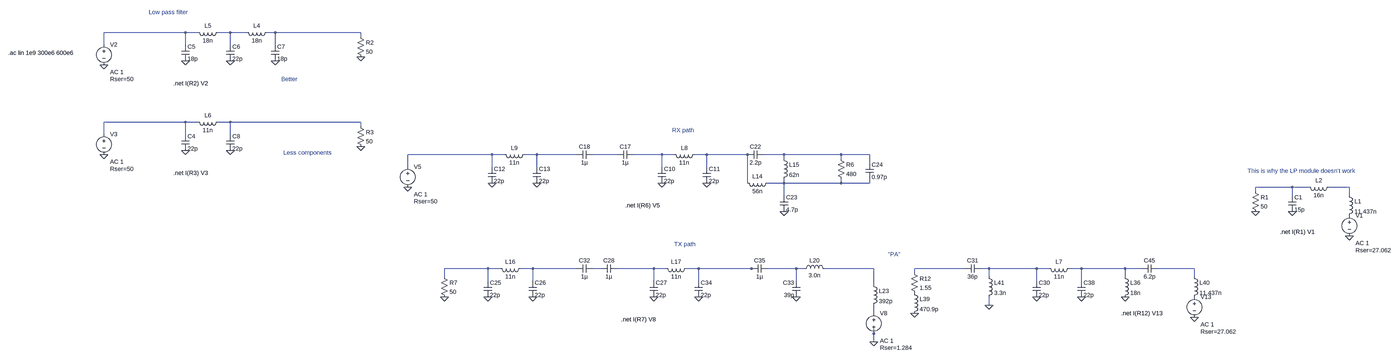
[diagram p0: schematic HP_module.asc, whole sheet]
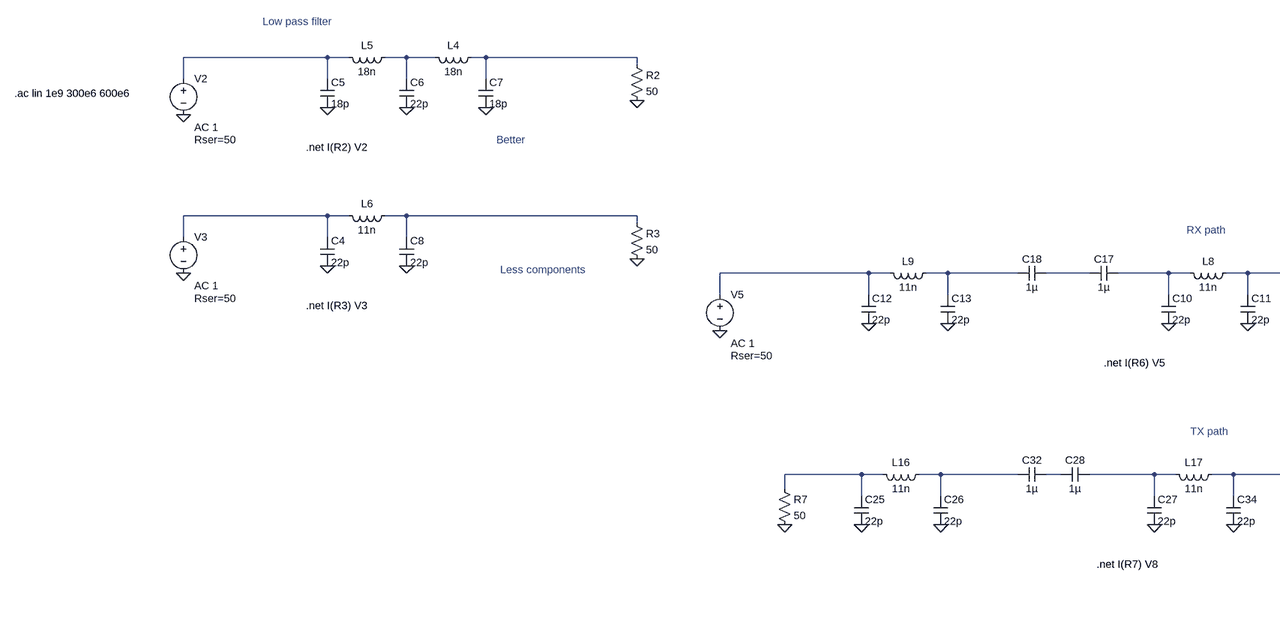
[diagram p1: schematic HP_module.asc, part, row 1 of 1, column 1 of 2]
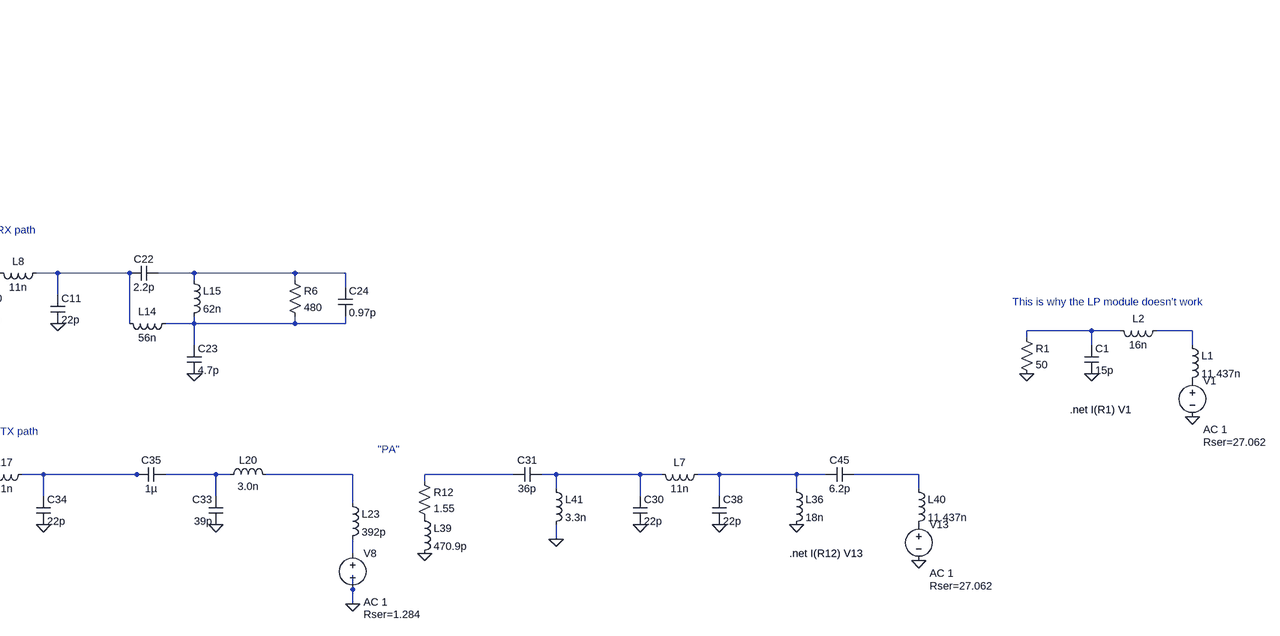
[diagram p2: schematic HP_module.asc, part, row 1 of 1, column 2 of 2]
HP_module.asc, the LTspice schematic file:
Version 4
SHEET 1 6100 2548
WIRE 304 656 -16 656
WIRE 352 656 304 656
WIRE 480 656 432 656
WIRE 544 656 480 656
WIRE 656 656 624 656
WIRE 992 656 656 656
WIRE 992 672 992 656
WIRE -16 704 -16 656
WIRE 304 704 304 656
WIRE 480 704 480 656
WIRE 656 704 656 656
WIRE 304 1072 -16 1072
WIRE 352 1072 304 1072
WIRE 480 1072 432 1072
WIRE 992 1072 480 1072
WIRE 992 1088 992 1072
WIRE -16 1120 -16 1072
WIRE 304 1120 304 1072
WIRE 480 1120 480 1072
WIRE 1792 1200 1328 1200
WIRE 1840 1200 1792 1200
WIRE 1968 1200 1920 1200
WIRE 2128 1200 1968 1200
WIRE 2288 1200 2192 1200
WIRE 2464 1200 2352 1200
WIRE 2512 1200 2464 1200
WIRE 2640 1200 2592 1200
WIRE 2896 1200 2640 1200
WIRE 2912 1200 2896 1200
WIRE 3040 1200 2960 1200
WIRE 3264 1200 3040 1200
WIRE 3376 1200 3264 1200
WIRE 3040 1216 3040 1200
WIRE 3264 1216 3264 1200
WIRE 3376 1232 3376 1200
WIRE 1328 1248 1328 1200
WIRE 1792 1248 1792 1200
WIRE 1968 1248 1968 1200
WIRE 2464 1248 2464 1200
WIRE 2640 1248 2640 1200
WIRE 2896 1312 2896 1200
WIRE 3040 1312 3040 1296
WIRE 3040 1312 2976 1312
WIRE 3264 1312 3264 1296
WIRE 3264 1312 3040 1312
WIRE 3376 1312 3376 1296
WIRE 3376 1312 3264 1312
WIRE 5248 1328 5104 1328
WIRE 5312 1328 5248 1328
WIRE 5472 1328 5392 1328
WIRE 5104 1344 5104 1328
WIRE 3040 1360 3040 1312
WIRE 5248 1360 5248 1328
WIRE 5472 1360 5472 1328
WIRE 1776 1648 1472 1648
WIRE 1824 1648 1776 1648
WIRE 1952 1648 1904 1648
WIRE 2128 1648 1952 1648
WIRE 2224 1648 2192 1648
WIRE 2432 1648 2288 1648
WIRE 2480 1648 2432 1648
WIRE 2608 1648 2560 1648
WIRE 2912 1648 2608 1648
WIRE 2928 1648 2912 1648
WIRE 3088 1648 2976 1648
WIRE 3120 1648 3088 1648
WIRE 3392 1648 3200 1648
WIRE 3760 1648 3552 1648
WIRE 3856 1648 3824 1648
WIRE 4128 1648 3856 1648
WIRE 4176 1648 4128 1648
WIRE 4304 1648 4256 1648
WIRE 4592 1648 4304 1648
WIRE 4656 1648 4592 1648
WIRE 4864 1648 4720 1648
WIRE 3552 1664 3552 1648
WIRE 1472 1680 1472 1648
WIRE 3856 1680 3856 1648
WIRE 4592 1680 4592 1648
WIRE 4864 1680 4864 1648
WIRE 1776 1696 1776 1648
WIRE 1952 1696 1952 1648
WIRE 2432 1696 2432 1648
WIRE 2608 1696 2608 1648
WIRE 3088 1696 3088 1648
WIRE 4128 1696 4128 1648
WIRE 4304 1696 4304 1648
WIRE 3392 1712 3392 1648
WIRE 3856 1792 3856 1760
WIRE 3392 1824 3392 1792
WIRE 3392 1904 3392 1872
WIRE 3392 1936 3392 1904
FLAG 992 752 0
FLAG -16 784 0
FLAG 304 768 0
FLAG 656 768 0
FLAG 480 768 0
FLAG 992 1168 0
FLAG -16 1200 0
FLAG 304 1184 0
FLAG 480 1184 0
FLAG 1328 1328 0
FLAG 3040 1424 0
FLAG 3392 1936 0
FLAG 3088 1760 0
FLAG 1472 1760 0
FLAG 4592 1760 0
FLAG 3552 1824 0
FLAG 4864 1840 0
FLAG 3856 1792 0
FLAG 1776 1760 0
FLAG 1952 1760 0
FLAG 2432 1760 0
FLAG 2608 1760 0
FLAG 4128 1760 0
FLAG 4304 1760 0
FLAG 2464 1312 0
FLAG 2640 1312 0
FLAG 1792 1312 0
FLAG 1968 1312 0
FLAG 5472 1520 0
FLAG 5248 1424 0
FLAG 5104 1424 0
SYMBOL voltage -16 688 R0
WINDOW 123 24 124 Left 2
WINDOW 39 24 152 Left 2
SYMATTR Value2 AC 1
SYMATTR SpiceLine Rser=50
SYMATTR InstName V2
SYMATTR Value ""
SYMBOL cap 288 704 R0
SYMATTR InstName C5
SYMATTR Value 18p
SYMBOL res 976 656 R0
SYMATTR InstName R2
SYMATTR Value 50
SYMBOL cap 464 704 R0
SYMATTR InstName C6
SYMATTR Value 22p
SYMBOL cap 640 704 R0
SYMATTR InstName C7
SYMATTR Value 18p
SYMBOL ind 640 640 R90
WINDOW 0 5 56 VBottom 2
WINDOW 3 32 56 VTop 2
SYMATTR InstName L4
SYMATTR Value 18n
SYMBOL ind 448 640 R90
WINDOW 0 5 56 VBottom 2
WINDOW 3 32 56 VTop 2
SYMATTR InstName L5
SYMATTR Value 18n
SYMBOL voltage -16 1104 R0
WINDOW 123 24 124 Left 2
WINDOW 39 24 152 Left 2
SYMATTR Value2 AC 1
SYMATTR SpiceLine Rser=50
SYMATTR InstName V3
SYMATTR Value ""
SYMBOL cap 288 1120 R0
SYMATTR InstName C4
SYMATTR Value 22p
SYMBOL res 976 1072 R0
SYMATTR InstName R3
SYMATTR Value 50
SYMBOL cap 464 1120 R0
SYMATTR InstName C8
SYMATTR Value 22p
SYMBOL ind 448 1056 R90
WINDOW 0 5 56 VBottom 2
WINDOW 3 32 56 VTop 2
SYMATTR InstName L6
SYMATTR Value 11n
SYMBOL voltage 1328 1232 R0
WINDOW 123 24 124 Left 2
WINDOW 39 24 152 Left 2
SYMATTR Value2 AC 1
SYMATTR SpiceLine Rser=50
SYMATTR InstName V5
SYMATTR Value ""
SYMBOL cap 2352 1184 R90
WINDOW 0 0 32 VBottom 2
WINDOW 3 32 32 VTop 2
SYMATTR InstName C17
SYMATTR Value 1µ
SYMBOL cap 2192 1184 R90
WINDOW 0 0 32 VBottom 2
WINDOW 3 32 32 VTop 2
SYMATTR InstName C18
SYMATTR Value 1µ
SYMBOL cap 2960 1184 R90
WINDOW 0 0 32 VBottom 2
WINDOW 3 32 32 VTop 2
SYMATTR InstName C22
SYMATTR Value 2.2p
SYMBOL ind 2992 1296 R90
WINDOW 0 5 56 VBottom 2
WINDOW 3 32 56 VTop 2
SYMATTR InstName L14
SYMATTR Value 56n
SYMBOL ind 3024 1200 R0
SYMATTR InstName L15
SYMATTR Value 62n
SYMBOL cap 3024 1360 R0
SYMATTR InstName C23
SYMATTR Value 4.7p
SYMBOL res 3248 1200 R0
SYMATTR InstName R6
SYMATTR Value 480
SYMBOL cap 3360 1232 R0
SYMATTR InstName C24
SYMATTR Value 0.97p
SYMBOL cap 2288 1632 R90
WINDOW 0 0 32 VBottom 2
WINDOW 3 32 32 VTop 2
SYMATTR InstName C28
SYMATTR Value 1µ
SYMBOL cap 3104 1760 R180
WINDOW 0 24 56 Left 2
WINDOW 3 24 8 Left 2
SYMATTR InstName C33
SYMATTR Value 39p
SYMBOL ind 3104 1664 R270
WINDOW 0 32 56 VTop 2
WINDOW 3 5 56 VBottom 2
SYMATTR InstName L20
SYMATTR Value 3.0n
SYMBOL voltage 3392 1808 R0
WINDOW 123 24 124 Left 2
WINDOW 39 24 152 Left 2
SYMATTR Value2 AC 1
SYMATTR SpiceLine Rser=1.284
SYMATTR InstName V8
SYMATTR Value ""
SYMBOL cap 2912 1664 R270
WINDOW 0 32 32 VTop 2
WINDOW 3 0 32 VBottom 2
SYMATTR InstName C35
SYMATTR Value 1µ
SYMBOL ind 3376 1696 R0
SYMATTR InstName L23
SYMATTR Value 392p
SYMBOL cap 2192 1632 R90
WINDOW 0 0 32 VBottom 2
WINDOW 3 32 32 VTop 2
SYMATTR InstName C32
SYMATTR Value 1µ
SYMBOL res 1456 1664 R0
SYMATTR InstName R7
SYMATTR Value 50
SYMBOL ind 4576 1664 R0
SYMATTR InstName L36
SYMATTR Value 18n
SYMBOL cap 4720 1632 R90
WINDOW 0 0 32 VBottom 2
WINDOW 3 32 32 VTop 2
SYMATTR InstName C45
SYMATTR Value 6.2p
SYMBOL res 3536 1648 R0
SYMATTR InstName R12
SYMATTR Value 1.55
SYMBOL ind 3536 1728 R0
SYMATTR InstName L39
SYMATTR Value 470.9p
SYMBOL voltage 4864 1744 R0
WINDOW 123 24 124 Left 2
WINDOW 39 24 152 Left 2
SYMATTR InstName V13
SYMATTR Value ""
SYMATTR Value2 AC 1
SYMATTR SpiceLine Rser=27.062
SYMBOL ind 4848 1664 R0
SYMATTR InstName L40
SYMATTR Value 11.437n
SYMBOL ind 3840 1664 R0
SYMATTR InstName L41
SYMATTR Value 3.3n
SYMBOL cap 3760 1664 R270
WINDOW 0 32 32 VTop 2
WINDOW 3 0 32 VBottom 2
SYMATTR InstName C31
SYMATTR Value 36p
SYMBOL cap 1760 1696 R0
SYMATTR InstName C25
SYMATTR Value 22p
SYMBOL cap 1936 1696 R0
SYMATTR InstName C26
SYMATTR Value 22p
SYMBOL ind 1920 1632 R90
WINDOW 0 5 56 VBottom 2
WINDOW 3 32 56 VTop 2
SYMATTR InstName L16
SYMATTR Value 11n
SYMBOL cap 2416 1696 R0
SYMATTR InstName C27
SYMATTR Value 22p
SYMBOL cap 2592 1696 R0
SYMATTR InstName C34
SYMATTR Value 22p
SYMBOL ind 2576 1632 R90
WINDOW 0 5 56 VBottom 2
WINDOW 3 32 56 VTop 2
SYMATTR InstName L17
SYMATTR Value 11n
SYMBOL cap 4112 1696 R0
SYMATTR InstName C30
SYMATTR Value 22p
SYMBOL cap 4288 1696 R0
SYMATTR InstName C38
SYMATTR Value 22p
SYMBOL ind 4272 1632 R90
WINDOW 0 5 56 VBottom 2
WINDOW 3 32 56 VTop 2
SYMATTR InstName L7
SYMATTR Value 11n
SYMBOL cap 2448 1248 R0
SYMATTR InstName C10
SYMATTR Value 22p
SYMBOL cap 2624 1248 R0
SYMATTR InstName C11
SYMATTR Value 22p
SYMBOL ind 2608 1184 R90
WINDOW 0 5 56 VBottom 2
WINDOW 3 32 56 VTop 2
SYMATTR InstName L8
SYMATTR Value 11n
SYMBOL cap 1776 1248 R0
SYMATTR InstName C12
SYMATTR Value 22p
SYMBOL cap 1952 1248 R0
SYMATTR InstName C13
SYMATTR Value 22p
SYMBOL ind 1936 1184 R90
WINDOW 0 5 56 VBottom 2
WINDOW 3 32 56 VTop 2
SYMATTR InstName L9
SYMATTR Value 11n
SYMBOL voltage 5472 1424 R0
WINDOW 123 24 124 Left 2
WINDOW 39 24 152 Left 2
SYMATTR InstName V1
SYMATTR Value ""
SYMATTR Value2 AC 1
SYMATTR SpiceLine Rser=27.062
SYMBOL ind 5456 1344 R0
SYMATTR InstName L1
SYMATTR Value 11.437n
SYMBOL ind 5408 1312 R90
WINDOW 0 5 56 VBottom 2
WINDOW 3 32 56 VTop 2
SYMATTR InstName L2
SYMATTR Value 16n
SYMBOL cap 5232 1360 R0
SYMATTR InstName C1
SYMATTR Value 15p
SYMBOL res 5088 1328 R0
SYMATTR InstName R1
SYMATTR Value 50
TEXT 160 576 Left 2 ;Low pass filter
TEXT 256 856 Left 2 !.net I(R2) V2
TEXT -392 736 Left 2 !.ac lin 1e9 300e6 600e6
TEXT 256 1272 Left 2 !.net I(R3) V3
TEXT 2504 1104 Left 2 ;RX path
TEXT 2320 1400 Left 2 !.net I(R6) V5
TEXT 2304 1848 Left 2 !.net I(R7) V8
TEXT 4576 1824 Left 2 !.net I(R12) V13
TEXT 2512 1552 Left 2 ;TX path
TEXT 3448 1592 Left 2 ;"PA"
TEXT 680 840 Left 2 ;Better
TEXT 688 1192 Left 2 ;Less components
TEXT 5200 1504 Left 2 !.net I(R1) V1
TEXT 5072 1264 Left 2 ;This is why the LP module doesn't work

The netlist it stands for:
* HP_module.asc
V2 N001 0 AC 1 Rser=50
C5 N001 0 18p
R2 N003 0 50
C6 N002 0 22p
C7 N003 0 18p
L4 N003 N002 18n
L5 N002 N001 18n
V3 N004 0 AC 1 Rser=50
C4 N004 0 22p
R3 N005 0 50
C8 N005 0 22p
L6 N005 N004 11n
V5 N006 0 AC 1 Rser=50
C17 N009 N008 1µ
C18 N008 N007 1µ
C22 N011 N010 2.2p
L14 N012 N010 56n
L15 N011 N012 62n
C23 N012 0 4.7p
R6 N011 N012 480
C24 N011 N012 0.97p
C28 N018 N017 1µ
C33 0 N020 39p
L20 N020 N021 3.0n
V8 N026 0 AC 1 Rser=1.284
C35 N019 N020 1µ
L23 N021 N026 392p
C32 N017 N016 1µ
R7 N015 0 50
L36 N024 0 18n
C45 N025 N024 6.2p
R12 N022 P001 1.55
L39 P001 0 470.9p
V13 P002 0 AC 1 Rser=27.062
L40 N025 P002 11.437n
L41 N023 0 3.3n
C31 N022 N023 36p
C25 N015 0 22p
C26 N016 0 22p
L16 N016 N015 11n
C27 N018 0 22p
C34 N019 0 22p
L17 N019 N018 11n
C30 N023 0 22p
C38 N024 0 22p
L7 N024 N023 11n
C10 N009 0 22p
C11 N010 0 22p
L8 N010 N009 11n
C12 N006 0 22p
C13 N007 0 22p
L9 N007 N006 11n
V1 P003 0 AC 1 Rser=27.062
L1 N014 P003 11.437n
L2 N014 N013 16n
C1 N013 0 15p
R1 N013 0 50
* Low pass filter
.net I(R2) V2
.ac lin 1e9 300e6 600e6
.net I(R3) V3
* RX path
.net I(R6) V5
.net I(R7) V8
.net I(R12) V13
* TX path
* "PA"
* Better
* Less components
.net I(R1) V1
* This is why the LP module doesn't work
.backanno
.end